# EAGLE schematic O2_Clone_V_Orig (EAGLE 7.2.0)

## Sheet 1 of 3: PWR In
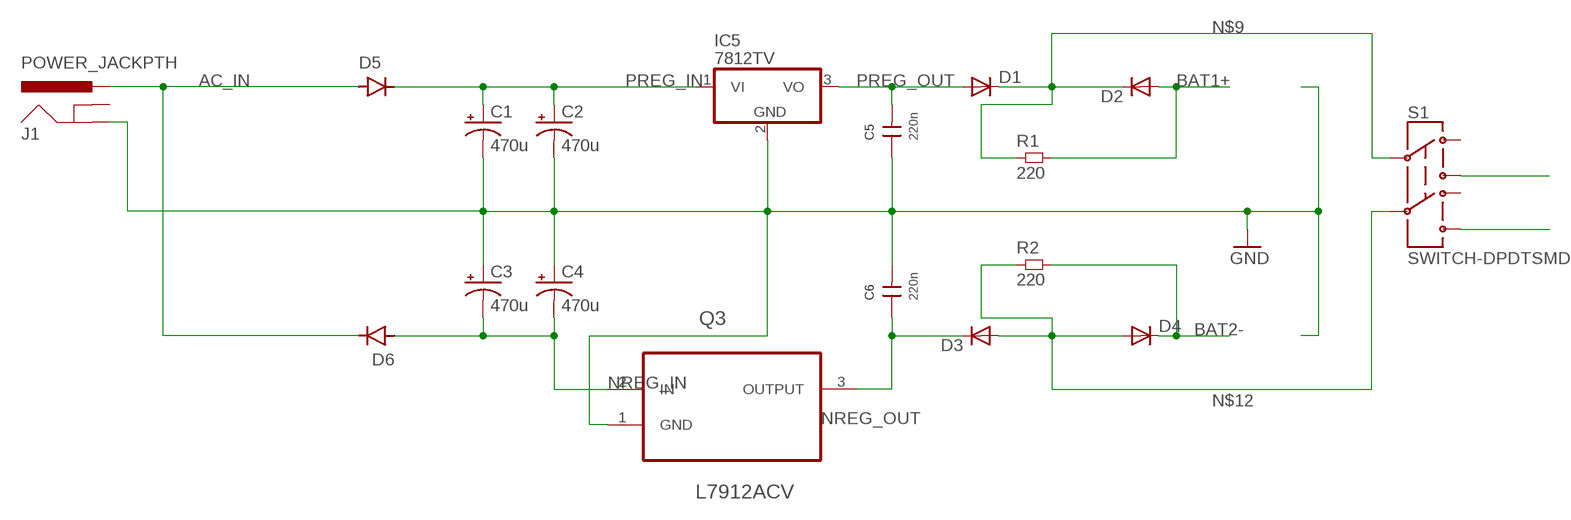
[diagram p0: schematic, sheet 1]

### Parts
C1  470u  CPOL-USE5-10.5  [E5-10,5]
C2  470u  CPOL-USE5-10.5  [E5-10,5]
C3  470u  CPOL-USE5-10.5  [E5-10,5]
C4  470u  CPOL-USE5-10.5  [E5-10,5]
C5  220n  220NF63VMKS2  [3,0X7,5RM5,0]
C6  220n  220NF63VMKS2  [3,0X7,5RM5,0]
D1  DIODE-SMB  [SMB]
D2  DIODE-SMB  [SMB]
D3  DIODE-SMB  [SMB]
D4  DIODE-SMB  [SMB]
D5  DIODE-SMX  [SMX]
D6  DIODE-SMX  [SMX]
IC5  7812TV  [TO220V]
J1  POWER_JACKPTH  [POWER_JACK_PTH]
Q3  L7912ACV  [TO254P450X1020X1935-3P]
R1  220  RES0603L3  [0603L3]
R2  220  RES0603L3  [0603L3]
S1  SWITCH-DPDTSMD  [AYZ0202]

### Nets
AC_IN: D5.1(ANODE) D6.2(CATHODE) J1.PWR
BAT1+: D2.A R1.P$2
BAT2-: D4.C R2.P$2
GND: C1.- C2.- C3.+ C4.+ C5.1 C6.2 IC5.2(GND) J1.GND Q3.1(GND) ; also sheet 2,3
N$9: D1.C D2.C R1.P$1 S1.2
N$12: D3.A D4.A R2.P$1 S1.5
NEG_OUT: S1.6
NREG_IN: C3.- C4.- D6.1(ANODE) Q3.2(IN)
NREG_OUT: C6.1 D3.C Q3.3(OUTPUT)
POS_OUT: S1.3
PREG_IN: C1.+ C2.+ D5.2(CATHODE) IC5.1(VI)
PREG_OUT: C5.2 D1.A IC5.3(VO)
Unconnected: J1.GNDBREAK S1.1 S1.4

## Sheet 2 of 3: PWR Manager
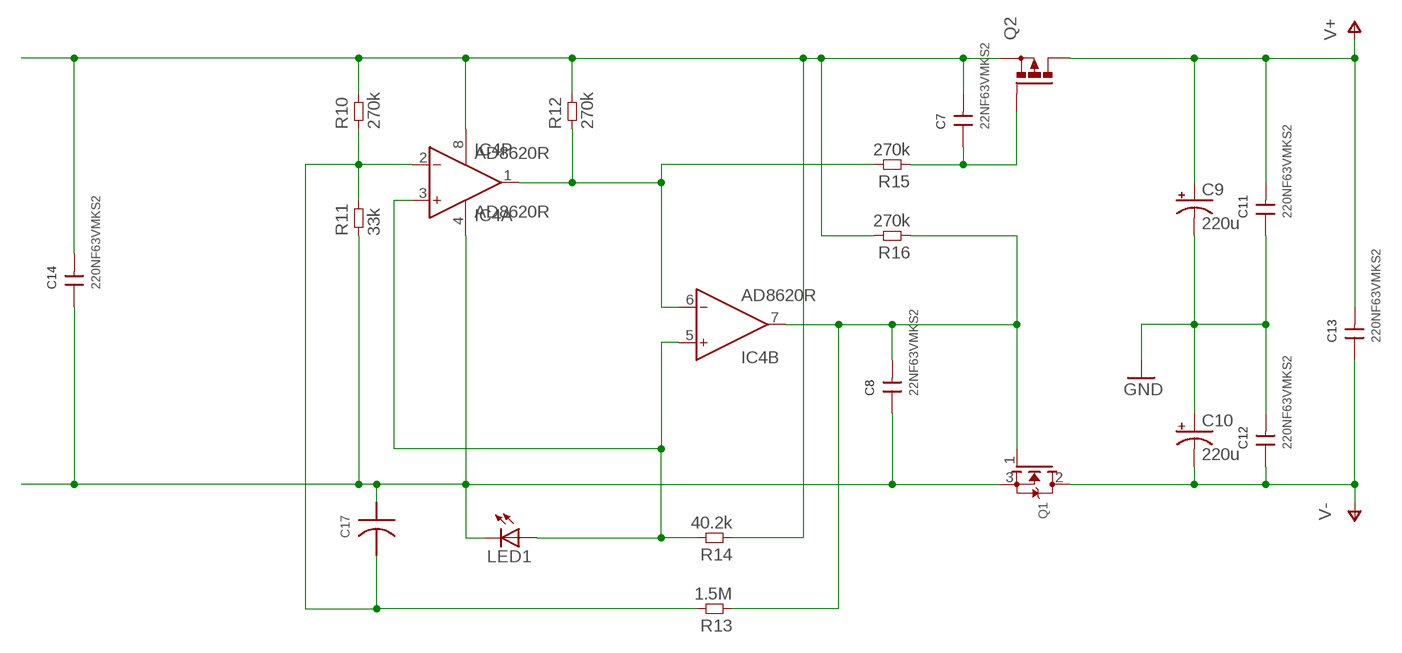
[diagram p1: schematic, sheet 2]

### Parts
C7  22NF63VMKS2  [2,5X6,5RM5,0]
C8  22NF63VMKS2  [2,5X6,5RM5,0]
C9  220u  CPOL-USE3.5-8  [E3,5-8]
C10  220u  CPOL-USE3.5-8  [E3,5-8]
C11  220NF63VMKS2  [3,0X7,5RM5,0]
C12  220NF63VMKS2  [3,0X7,5RM5,0]
C13  220NF63VMKS2  [3,0X7,5RM5,0]
C14  220NF63VMKS2  [3,0X7,5RM5,0]
C17  PCAP0805LEVEL3  [R0805]
IC4  AD8620R  [SO8]
LED1  LED3MM  [LED3MM]
Q1  MOSFET-NGDS_TO220V  [TO220V]
Q2  PMOSFET_PTO220BV  [TO220BV]
R10  270k  RES0603L3  [0603L3]
R11  33k  RES0603L3  [0603L3]
R12  270k  RES0603L3  [0603L3]
R13  1.5M  RES0603L3  [0603L3]
R14  40.2k  RES0603L3  [0603L3]
R15  270k  RES0603L3  [0603L3]
R16  270k  RES0603L3  [0603L3]

### Nets
GND: C9.- C10.+ C11.1 C12.2 ; also sheet 1,3
N$1: IC4.1(A:OUT) IC4.6(B:IN-) R12.P$1 R15.P$2
N$2: IC4.3(A:IN+) IC4.5(B:IN+) LED1.A R14.P$2
N$3: C8.1 C14.1 C17.P$2 IC4.4(P:V-) LED1.K(C) Q1.3(S) R11.P$1
N$4: C17.P$1 IC4.2(A:IN-) R10.P$1 R11.P$2 R13.P$2
N$6: C7.2 C14.2 IC4.8(P:V+) Q2.S R10.P$2 R12.P$2 R14.P$1 R16.P$2
N$14: C7.1 Q2.G R15.P$1
N$15: C8.2 IC4.7(B:OUT) Q1.1(G) R13.P$1 R16.P$1
V+: C9.+ C11.2 C13.2 Q2.D ; also sheet 3
V-: C10.- C12.1 C13.1 Q1.2(D) ; also sheet 3

## Sheet 3 of 3: Amp
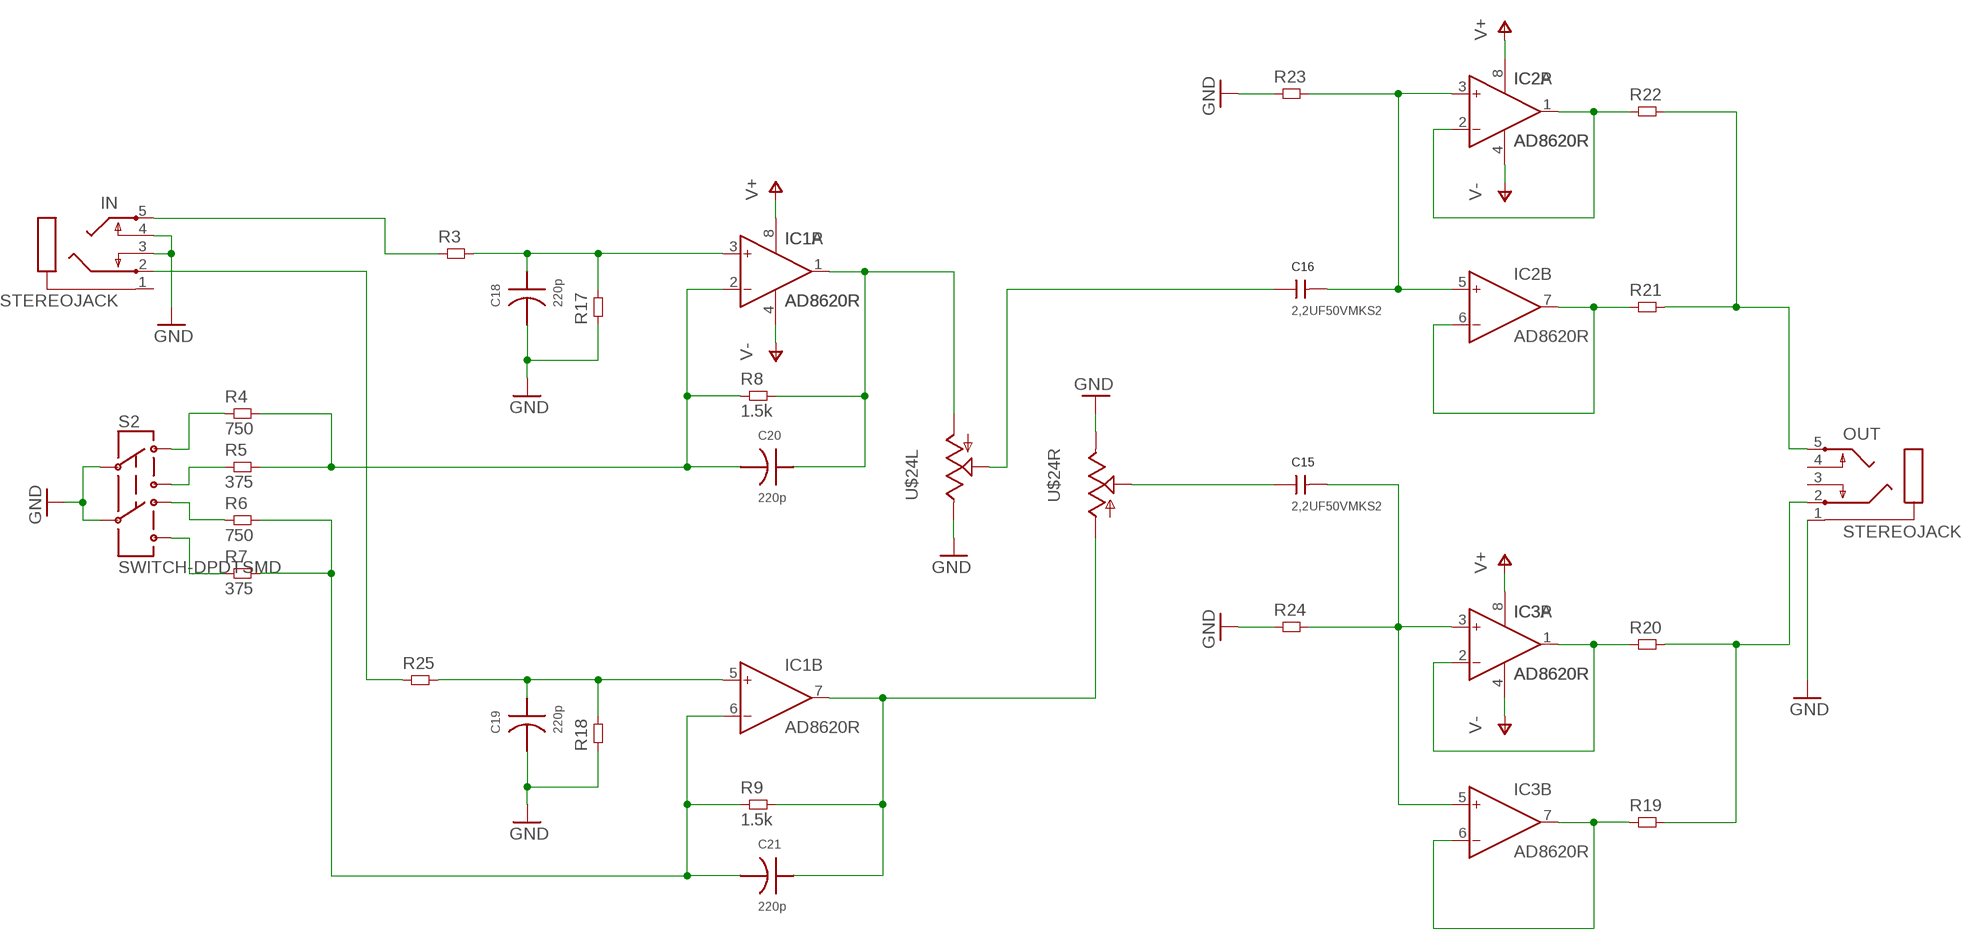
[diagram p2: schematic, sheet 3]

### Parts
C15  2,2UF50VMKS2  [7,2X13,0RM5,0]
C16  2,2UF50VMKS2  [7,2X13,0RM5,0]
C18  220p  PCAP0603LEVEL3  [R0603]
C19  220p  PCAP0603LEVEL3  [R0603]
C20  220p  PCAP0603LEVEL3  [R0603]
C21  220p  PCAP0603LEVEL3  [R0603]
IC1  AD8620R  [SO8]
IC2  AD8620R  [SO8]
IC3  AD8620R  [SO8]
IN  STEREOJACK  [STX3100]
OUT  STEREOJACK  [STX3100]
R3  RES0603L3  [0603L3]
R4  750  RES0603L3  [0603L3]
R5  375  RES0603L3  [0603L3]
R6  750  RES0603L3  [0603L3]
R7  375  RES0603L3  [0603L3]
R8  1.5k  RES0603L3  [0603L3]
R9  1.5k  RES0603L3  [0603L3]
R17  RES0603L3  [0603L3]
R18  RES0603L3  [0603L3]
R19  RES0603L3  [0603L3]
R20  RES0603L3  [0603L3]
R21  RES0603L3  [0603L3]
R22  RES0603L3  [0603L3]
R23  RES0603L3  [0603L3]
R24  RES0603L3  [0603L3]
R25  RES0603L3  [0603L3]
S2  SWITCH-DPDTSMD  [AYZ0202]
U$24  ALPS_RK0971221Z0N  [ALPS_RK0971221Z0X]

### Nets
GND: C18.P$1 C19.P$1 IN.3 IN.4 OUT.1 R17.P$1 R18.P$1 R23.P$1 R24.P$1 S2.2 S2.5 U$24.I1 U$24.I2 ; also sheet 1,2
N$5: IC2.1(A:OUT) IC2.2(A:IN-) R22.P$1
N$8: IC2.6(B:IN-) IC2.7(B:OUT) R21.P$1
N$10: IC3.1(A:OUT) IC3.2(A:IN-) R20.P$1
N$13: IC3.6(B:IN-) IC3.7(B:OUT) R19.P$1
N$16: OUT.5 R21.P$2 R22.P$2
N$17: OUT.2 R19.P$2 R20.P$2
N$18: C16.2 IC2.3(A:IN+) IC2.5(B:IN+) R23.P$2
N$19: C15.2 IC3.3(A:IN+) IC3.5(B:IN+) R24.P$2
N$20: C20.P$2 IC1.1(A:OUT) R8.P$2 U$24.G1
N$21: C20.P$1 IC1.2(A:IN-) R4.P$2 R5.P$2 R8.P$1
N$22: C21.P$2 IC1.7(B:OUT) R9.P$2 U$24.G2
N$23: C15.1 U$24.O2
N$24: C18.P$2 IC1.3(A:IN+) R3.P$2 R17.P$2
N$25: C19.P$2 IC1.5(B:IN+) R18.P$2 R25.P$2
N$26: IN.5 R3.P$1
N$27: IN.2 R25.P$1
N$28: R5.P$1 S2.3
N$29: R6.P$1 S2.4
N$30: R4.P$1 S2.1
N$31: R7.P$1 S2.6
N$32: C21.P$1 IC1.6(B:IN-) R6.P$2 R7.P$2 R9.P$1
N$33: C16.1 U$24.O1
V+: IC1.8(P:V+) IC2.8(P:V+) IC3.8(P:V+) ; also sheet 2
V-: IC1.4(P:V-) IC2.4(P:V-) IC3.4(P:V-) ; also sheet 2
Unconnected: IN.1 OUT.3 OUT.4

## Power pins joined to a net without a drawn wire
S1: U$24.S1
S2: U$24.S2

## Library data of the parts
C1-C4 C9 C10 = rcl:CPOL-US: POLARIZED CAPACITOR, American symbol
C5 C6 C11-C14 = wima_c:220NF63V
C7 C8 = wima_c:22NF63V
C15 C16 = wima_c:2,2UF50V
C17 = rcl_pro:PCAP0805
C18-C21 = rcl_pro:PCAP0603
D1-D4 = diode-1:DIODE-: DIODE
D5 D6 = diode_pro:DIODE-SMX
IC1-IC4 = analog-devices:AD8620: Precision, Very Low Noise, Low Input Bias Current, Wide Bandwidth JFET Operational Amplifiers Source: http://www.analog.com/static/imported-files/data_sheets/AD8610_8620.pdf; MF: ALTERA CORPORATION; MPN: AD8620ARZ; OC_FARNELL: 9994386; OC_NEWARK: 59K6972
IC5 = linear:78*: Positive VOLTAGE REGULATOR Source: http://cache.national.com/ds/LM/LM78L05.pdf http://www.fairchildsemi.com/ds/LM/LM7805.pdf
IN OUT = adafruit:STEREOJACK: MIC/HEADPHONE JACK Stereo jack with two switches. Kycon STX3100, CUI SJ1-3555NG and/or 4UCon 05544
J1 = SparkFun-Connectors:POWER_JACK: Power Jack This is the standard 5.5mm barrel jack for power. The PTH is the most common, proven, reliable, footprint. The Slot footprint only works if the mill layer is transmitted to the PCB fab house so be warned. Spark Fun Electronics SKU : PRT-00119 SMT: CONN-08106 Mating wall wart : TOL-00298 (and others)
LED1 = adafruit:LED: LED OSRAM: - CHIPLED LG R971, LG N971, LY N971, LG Q971, LY Q971, LO R971, LY R971 LH N974, LH R974 LS Q976, LO Q976, LY Q976 LO Q996 - Hyper CHIPLED LW Q18S LB Q993, LB Q99A, LB R99A - SideLED LS A670, LO A670, LY A670, LG A670, LP A670 LB A673, LV A673, LT A673, LW A673 LH A674 LY A675 LS A676, LA A676, LO A676, LY A676, LW A676 LS A679, LY A679, LG A679 - Hyper Micro SIDELED® LS Y876, LA Y876, LO Y876, LY Y876 LT Y87S - SmartLED LW L88C, LW L88S LB L89C, LB L89S, LG L890 LS L89K, LO L89K, LY L89K LS L896, LA L896, LO L896, LY L896 - TOPLED LS T670, LO T670, LY T670, LG T670, LP T670 LSG T670, LSP T670, LSY T670, LOP T670, LYG T670 LG T671, LOG T671, LSG T671 LB T673, LV T673, LT T673, LW T673 LH T674 LS T676, LA T676, LO T676, LY T676, LB T676, LH T676, LSB T676, LW T676 LB T67C, LV T67C, LT T67C, LS T67K, LO T67K, LY T67K, LW E67C LS E67B, LA E67B, LO E67B, LY E67B, LB E67C, LV E67C, LT E67C LW T67C LS T679, LY T679, LG T679 LS T770, LO T770, LY T770, LG T770, LP T770 LB T773, LV T773, LT T773, LW T773 LH T774 LS E675, LA E675, LY E675, LS T675 LS T776, LA T776, LO T776, LY T776, LB T776 LHGB T686 LT T68C, LB T68C - Hyper Mini TOPLED® LB M676 - Mini TOPLED Santana® LG M470 LS M47K, LO M47K, LY M47K Source: http://www.osram.convergy.de/
Q1 = adafruit:MOSFET-N: N-Channel Mosfet 2N7002E - 60V 260mA SOT23 [Digikey: 2N7002ET1GOSTR-ND] - REEL BSH103 - 30V 850mA SOT23 [Digikey: 568-5013-1-ND]
Q2 = transistor-power:PMOSFET_P: Power MOSFET P-Channel
Q3 = ST Microelctronics_By_element14_Batch_1:L7912ACV: 2 % negative voltage regulators; MPN: L7912ACV; OC_FARNELL: 1095391; OC_NEWARK: 89K0792; PACKAGE: TO-220; SUPPLIER: STMicroelectronics
R1-R25 = common:RES
S1 S2 = SparkFun:SWITCH-DPDT: DPDT Version of the COM-00597
U$24 = audio-pots:ALPS_RK0971221Z0*: ALPS RK0971221Z Dual-gang 9mm potentiometer for volume control, with SPST switch -05 model: 10K with "volume" taper -0N model: 50K with traditional audio taper